# EAGLE design anod_tap (EAGLE 7.4.0)
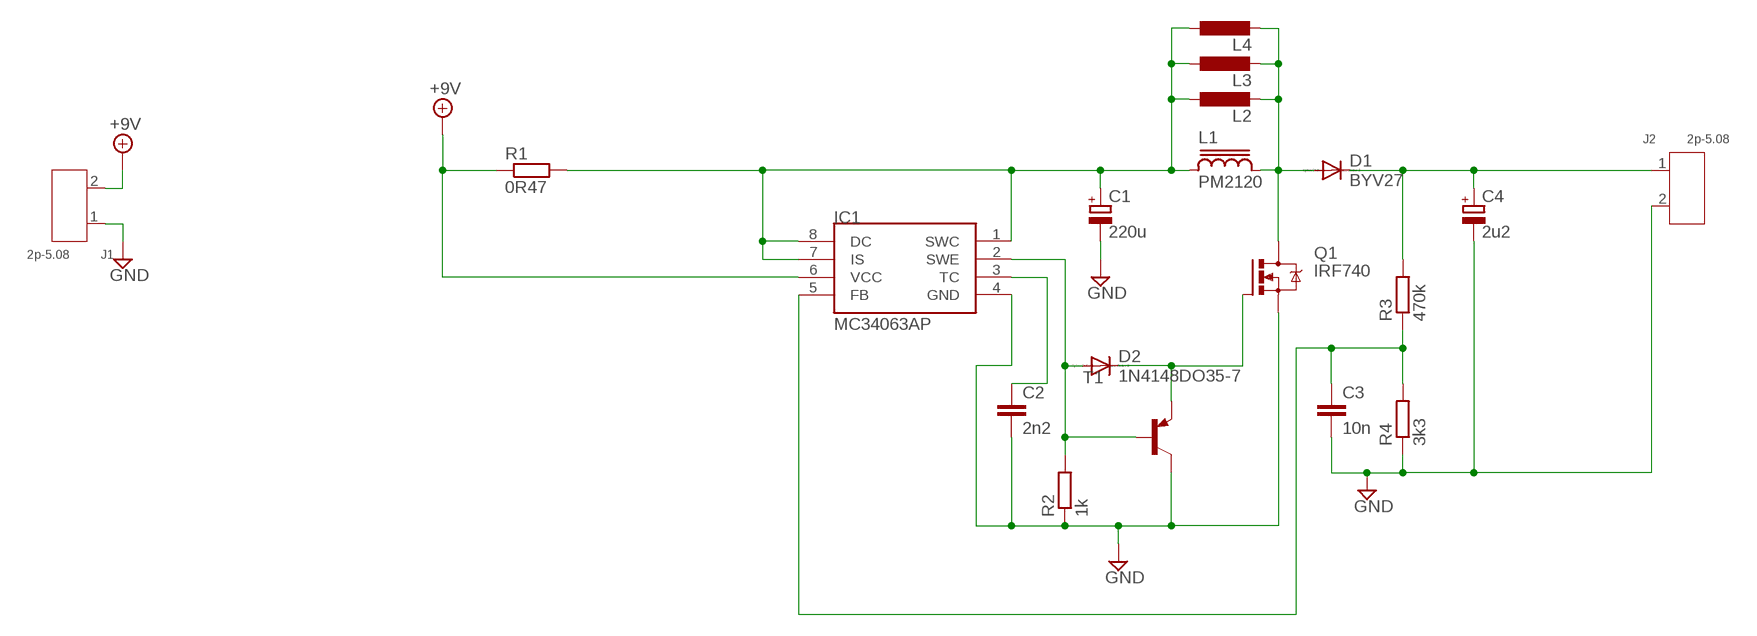
[diagram p0: schematic, sheet 1]

## Parts
C1  220u  CPOL-EUE3.5-8  [E3,5-8]
C2  2n2  C-EU050-024X044  [C050-024X044]
C3  10n  C-EU050-024X044  [C050-024X044]
C4  2u2  CPOL-EUE3.5-8  [E3,5-8]
D1  BYV27  [SOD57-10]
D2  1N4148DO35-7  [DO35-7]
IC1  MC34063AP  [DIL08]
J1  2p-5.08  DIP-BLUE-SCREW-TERMINAL(2P-5.08)  [H2-5.0-10.5X8.0MM]
J2  2p-5.08  DIP-BLUE-SCREW-TERMINAL(2P-5.08)  [H2-5.0-10.5X8.0MM]
L1  PM2120  [PM2120]
L2  L-EUTJ3-U1  [TJ3-U1]
L3  L-EUTJ3-U2  [TJ3-U2]
L4  L-EUTJ4-U2  [TJ4-U2]
Q1  IRF740  [TO220BV]
R1  0R47  R-EU_0922/22  [0922/22]
R2  1k  R-EU_0204/5  [0204/5]
R3  470k  R-EU_0204/5  [0204/5]
R4  3k3  R-EU_0204/5  [0204/5]
T1  MPSA92-PNP-TO92-EBC  [TO92-EBC]

## Nets
+9V: IC1.6(VCC) J1.2 R1.1
GND: C1.- C2.2 C3.2 C4.- IC1.4(GND) J1.1 J2.2 Q1.S R2.1 R4.1 T1.C
N$2: C1.+ IC1.1(SWC) IC1.7(IS) IC1.8(DC) L1.1 L2.1 L3.1 L4.1 R1.2
N$4: D2.A IC1.2(SWE) R2.2 T1.B
N$5: D2.C Q1.G T1.E
N$7: D1.A L1.2 L2.2 L3.2 L4.2 Q1.D
N$8: C2.1 IC1.3(TC)
N$11: C4.+ D1.C J2.1 R3.2
N$14: C3.1 IC1.5(FB) R3.1 R4.2

## Library data of the parts
C1 C4 = rcl:CPOL-EU: POLARIZED CAPACITOR, European symbol
C2 C3 = rcl:C-EU: CAPACITOR, European symbol
D1 = diode:BYV27: DIODE ultra fast
D2 = diode:1N4148: DIODE high speed (Philips)
IC1 = mc34063:MC34063
J1 J2 = Seeed-OPL-Connector:DIP-BLUE-SCREW-TERMINAL(2P-5.08): 320110006; MPN: GS009S-2P-2
L1 = inductor-bourns:PM2120: POWER INDUCTOR
L2-L4 = rcl:L-EU: INDUCTOR, European symbol
Q1 = transistor-power:IRF740: N-CHANNEL MOS FET
R1-R4 = rcl:R-EU_: RESISTOR, European symbol
T1 = transistor:*-PNP-: PNP Transistror

## Board
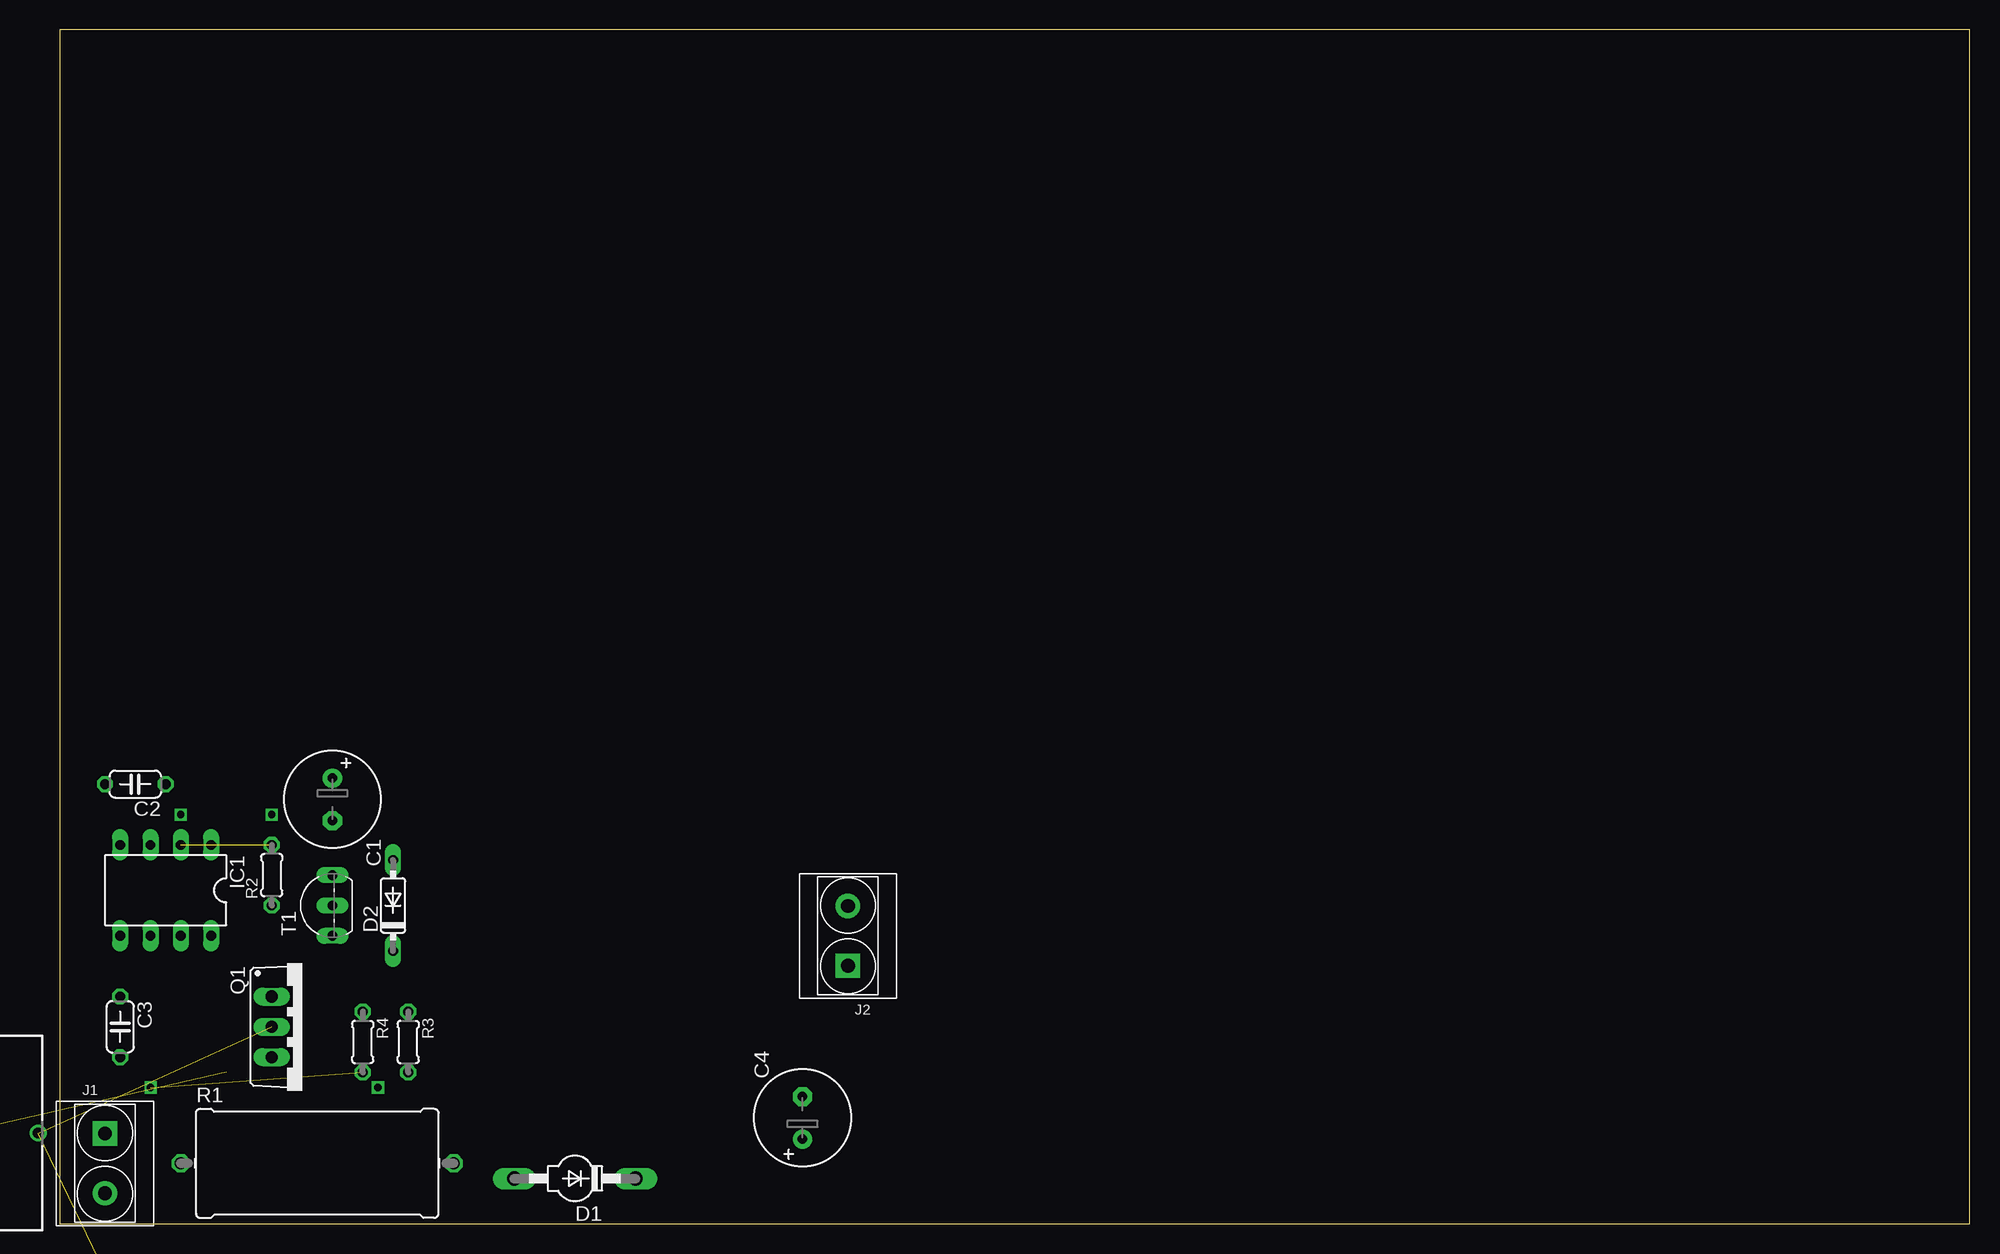
[diagram p1: board, top side]
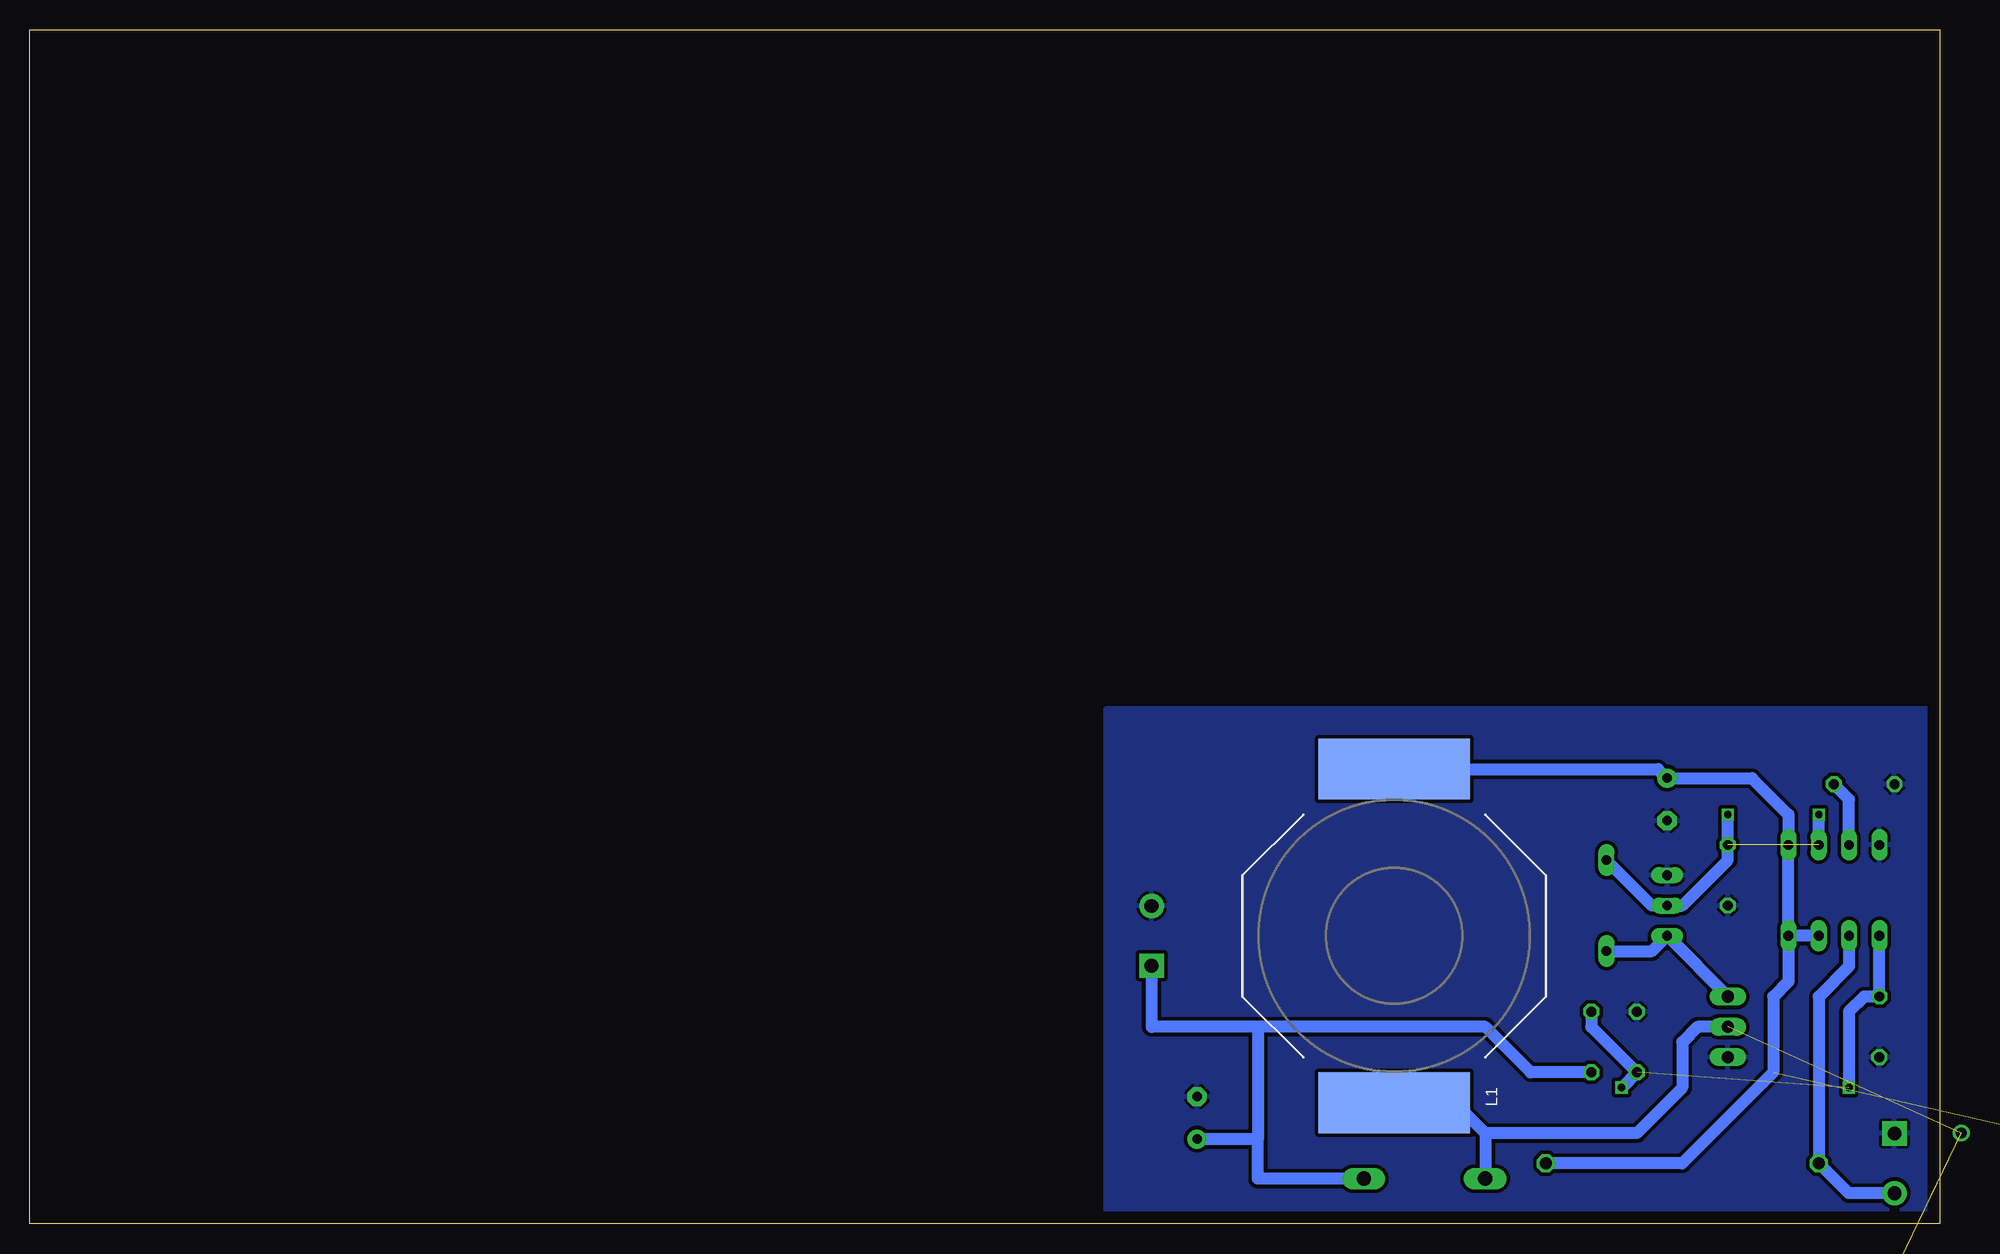
[diagram p2: board, bottom side, seen from below]

Size 160 x 100 mm. Coordinates in mm from the lower left corner, seen from the top.
Outline: 0,0 160,0 160,100 0,100 0,0
Copper layers (1*16): Top 0.035mm / dielectric 1.5mm / Bottom 0.035mm
Design rules "default *": minimum track width 10mil, minimum drill 24mil, track to track 12mil, track to pad 12mil, pad to pad 12mil, via to via 12mil, smd to smd 12mil, copper to edge 40mil, drill to drill 8mil, minimum pad ring 10mil, minimum via ring 8mil, stop-mask expansion 4mil, vias tented up to drill 0mil, thermal gap 10mil

### Footprints (pad centres in the part's own frame; a part is rotated, then mirrored left to right if it is on the bottom)
E3,5-8 = drill 0.813 pad 1.6: + -1.778,0 | drill 0.813 pad 1.6 octagon: - 1.778,0
C050-024X044 = drill 0.813 octagon: 1 -2.54,0; 2 2.54,0
SOD57-10 = drill 1.194 long: A 5.08,0; C -5.08,0
DO35-7 = drill 0.813 long: A 3.81,0; C -3.81,0
DIL08 = drill 0.813 long: 1 -3.81,-3.81; 2 -1.27,-3.81; 3 1.27,-3.81; 4 3.81,-3.81; 5 3.81,3.81; 6 1.27,3.81; 7 -1.27,3.81; 8 -3.81,3.81
H2-5.0-10.5X8.0MM = drill 1.168 pad 2.032 square: 1 0,2.5 | drill 1.168 pad 2.032: 2 0,-2.5
PM2120 = smd 5.08 x 12.7: 1 -13.97,0; 2 13.97,0
TJ3-U1 = drill 0.9: 1 -3.3,0; 2 3.3,0
TJ3-U2 = drill 0.9: 1 -7.35,0; 2 7.35,0
TJ4-U2 = drill 0.9: 1 -9.9,0; 2 9.9,0
TO220BV = drill 1.016 long: D 0,-2.54; G -2.54,-2.54; S 2.54,-2.54
0922/22 = drill 1.016 octagon: 1 -11.43,0; 2 11.43,0
0204/5 = drill 0.813 octagon: 1 -2.54,0; 2 2.54,0
TO92-EBC = drill 0.813 long: B 0,-1.27; C 2.54,-1.27; E -2.54,-1.27

### Placement (x,y rotation side)
C1  22.86,35.56 270 top
C2  6.35,36.83 180 top
C3  5.08,16.51 270 top
C4  62.23,8.89 90 top
D1  43.18,3.81 180 top
D2  27.94,26.67 90 top
IC1  8.89,27.94 180 top
J1  3.81,5.08 0 top
J2  66.04,24.13 180 top
L1  45.72,24.13 270 bottom
L2  -5.08,7.62 0 top
L3  0,-11.43 0 top  (outside the outline)
L4  2.54,-31.75 0 top  (outside the outline)
Q1  20.32,16.51 270 top
R1  21.59,5.08 0 top
R2  17.78,29.21 90 top
R3  29.21,15.24 270 top
R4  25.4,15.24 270 top
T1  21.59,26.67 90 top

### Tracks (layer width: path | path; a pad name or v marks a point on that pad's centre or on a via)
+9V
  Bottom 1.016: J1.2 7.66,2.58 R1.1 10.16,19.05 7.62,21.59 IC1.6
GND
  pour Bottom: 0,0 69.85,0 69.85,43.18 0,43.18
N$1  (via drill 0.6)
  other vias: 26.67,11.43
N$2  (3 unrouted)
  Bottom 1.016: IC1.8 IC1.1 12.7,34.29 15.75,37.34 C1.+ 23.62,38.1 L1.1 | IC1.7 IC1.8 | IC1.8 12.7,20.32 13.97,19.05 13.97,12.7 21.59,5.08 R1.2
N$3  (via drill 0.6)
  other vias: 7.62,11.43
N$4  (1 unrouted)
  Bottom 1.016: D2.A 24.13,26.67 T1.B 21.59,26.67 17.78,30.48 R2.2 17.78,34.29 | IC1.2 10.16,34.29
N$5
  Bottom 1.016: D2.C 24.13,22.86 T1.E Q1.G
N$6  (via drill 0.6)
  other vias: 10.16,34.29
N$7  (3 unrouted)
  Bottom 1.016: L1.2 40.64,10.16 38.1,7.62 | 38.1,7.62 D1.A | Q1.D 20.32,16.51 21.59,15.24 21.59,11.43 25.4,7.62 38.1,7.62
N$8
  Bottom 1.016: IC1.3 7.62,35.56 C2.1
N$9  (via drill 0.6)
  other vias: 17.78,34.29
N$11
  Bottom 1.016: R3.2 34.29,12.7 38.1,16.51 57.15,16.51 | 57.15,16.51 66.04,16.51 J2.1 | 57.15,16.51 57.15,7.11 | 57.15,7.11 C4.+ | D1.C 57.15,3.81 57.15,7.11
N$14  (1 unrouted)
  Bottom 1.016: IC1.5 C3.1 6.35,19.05 7.62,17.78 7.62,11.43 | R3.1 29.21,16.51 R4.2 26.67,11.43